# Altium schematic sheet USB-PD.SchDoc
size A2; SheetNumber: 2; SheetTotal: 17
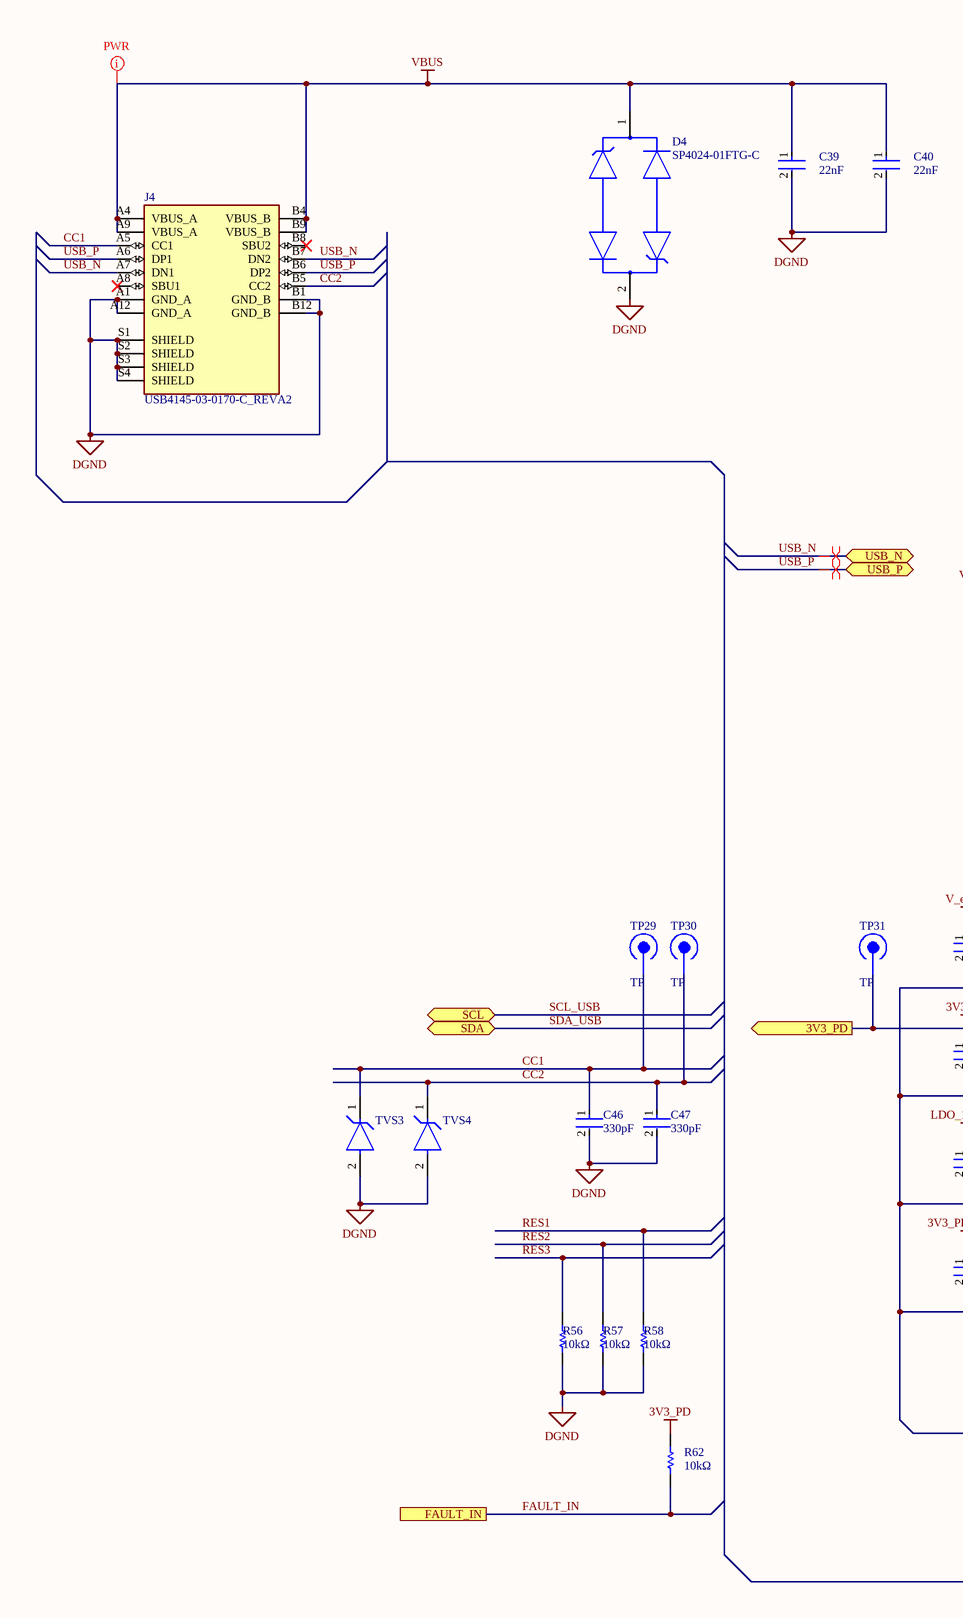
[diagram p0: USB-PD.SchDoc, left]
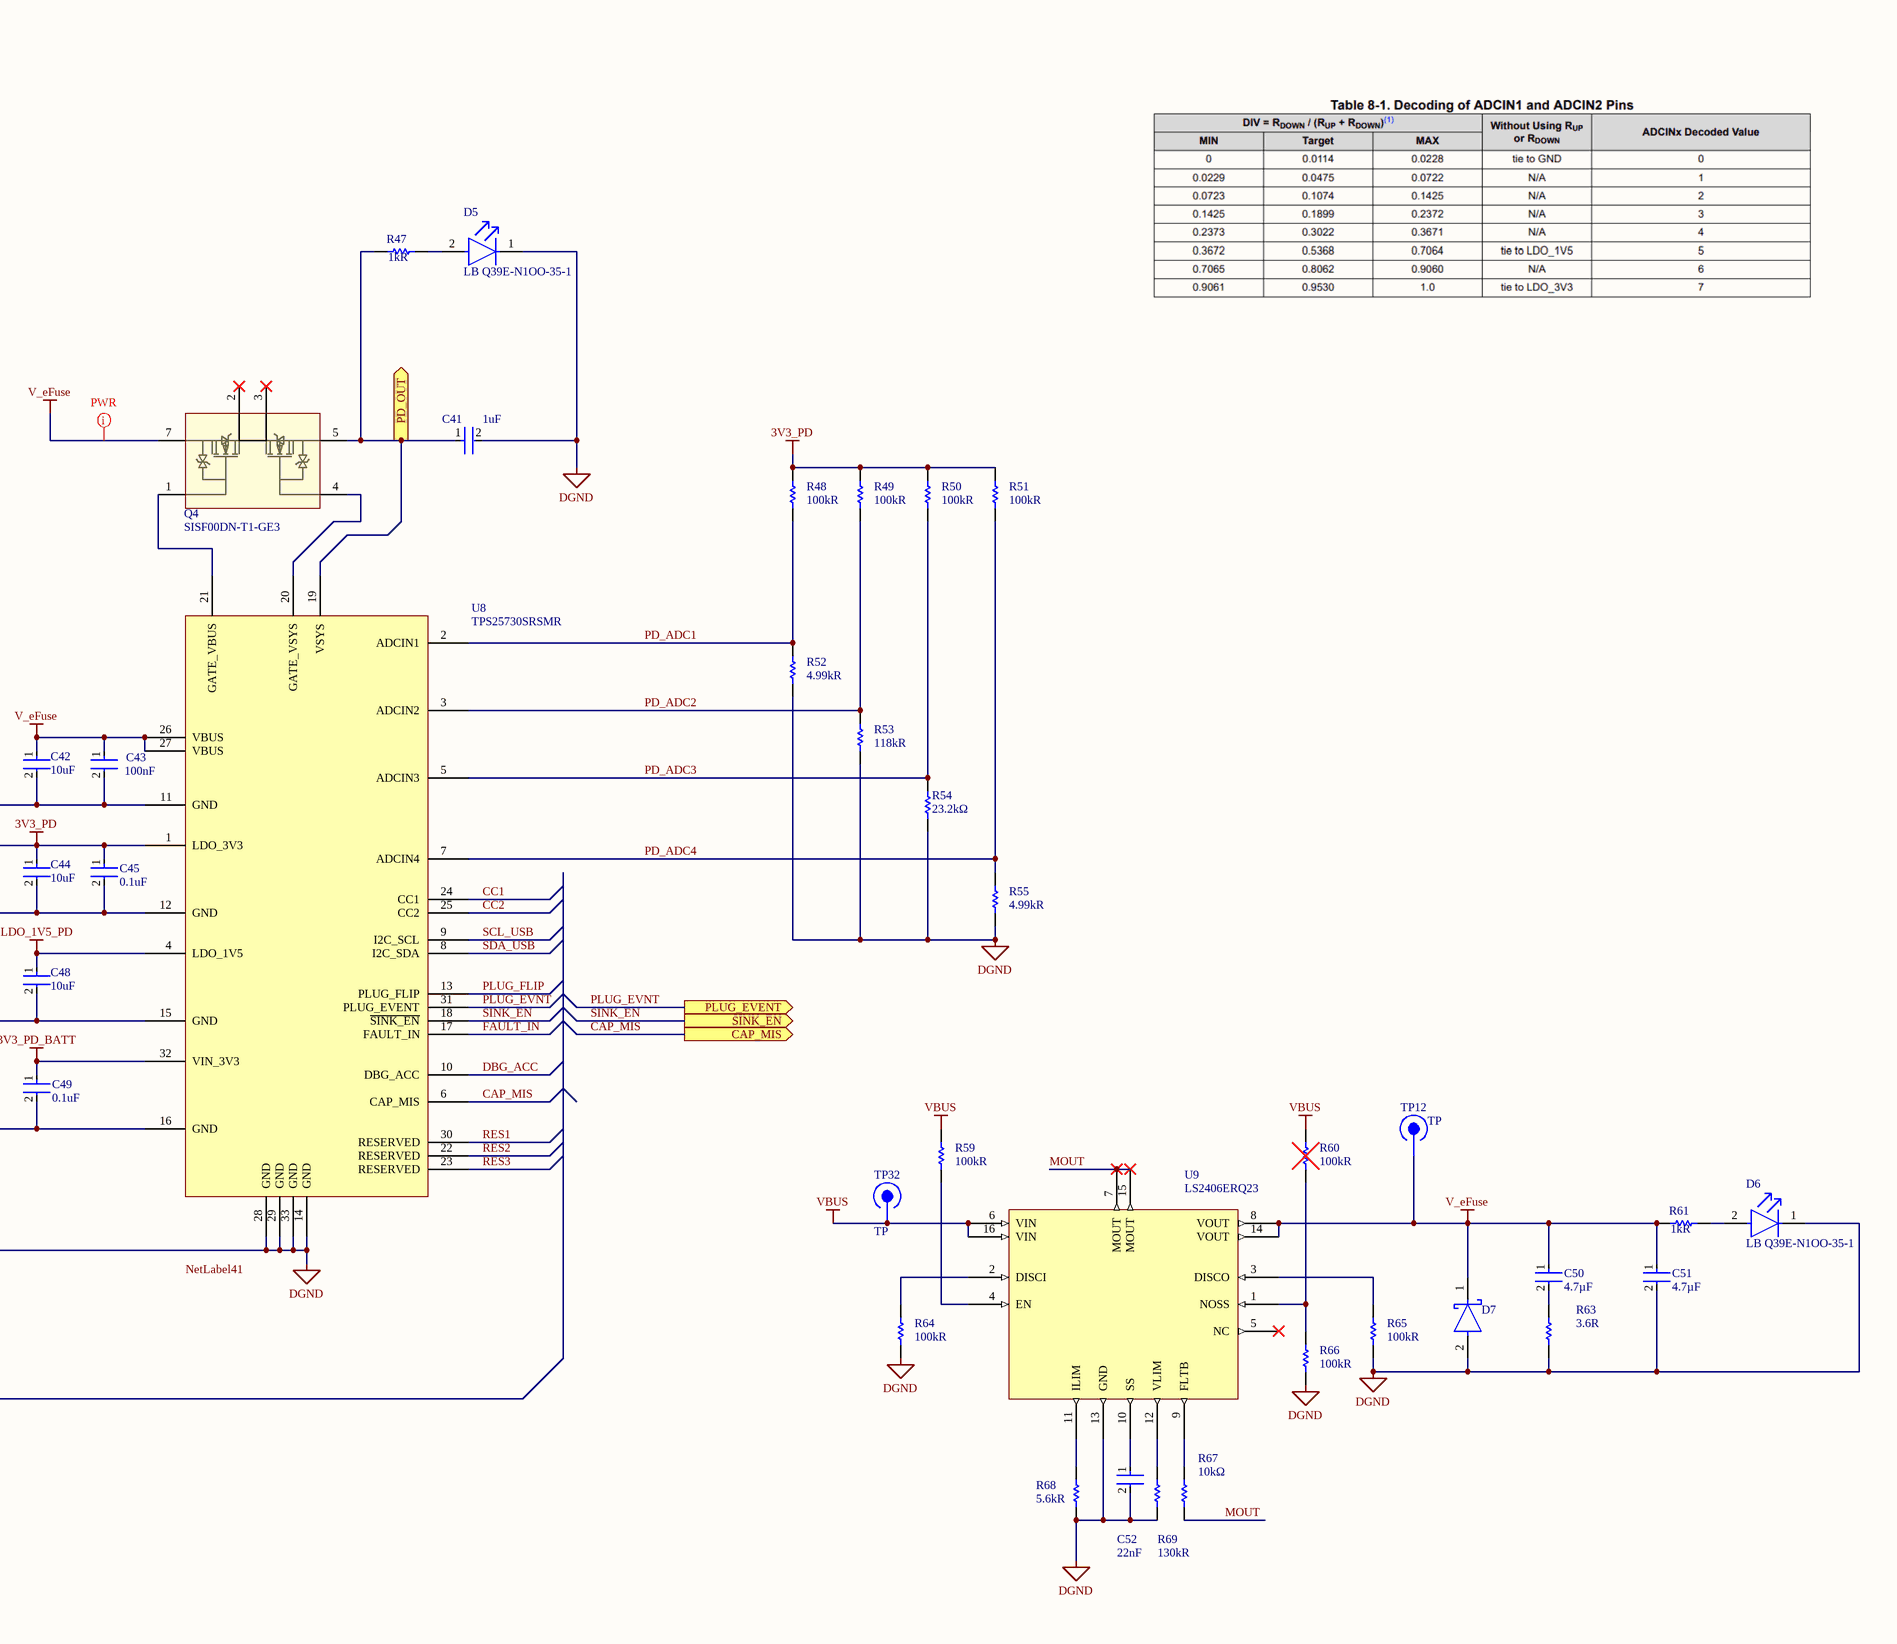
[diagram p1: USB-PD.SchDoc, right]

## Parts
C39  value 22nF  [FP-GRM155-0_05-MFG]  (hidden comment: GRM155R71H223KA12D)
C40  value 22nF  [FP-GRM155-0_05-MFG]  (hidden comment: GRM155R71H223KA12D)
C41  value 1uF  [FP-GCM188-0_1-IPC_B]  (hidden comment: GCM188R71E105KA64J)
C42  value 10uF  [FP-GRM155-0_2-MFG]  (hidden comment: GRM155R61A106ME11D)
C43  value 100nF  [FP-CC0402-IPC_B]  (hidden comment: CC0402KRX7R9BB104)
C44  value 10uF  [FP-GRM155-0_2-MFG]  (hidden comment: GRM155R61A106ME11D)
C45  value 0.1uF  [FP-CC0402-IPC_C]  (hidden comment: CC0402KRX7R7BB104)
C46  value 330pF  [FP-C0402-BB-MFG]  (hidden comment: C0402C331K5RACTU)
C47  value 330pF  [FP-C0402-BB-MFG]  (hidden comment: C0402C331K5RACTU)
C48  value 10uF  [FP-GRM155-0_2-MFG]  (hidden comment: GRM155R61A106ME11D)
C49  value 0.1uF  [FP-CC0402-IPC_C]  (hidden comment: CC0402KRX7R7BB104)
C50  value 4.7µF  [FP-GRM21B-0_15-IPC_A]  (hidden comment: GRM21BR61H475KE51L)
C51  value 4.7µF  [FP-GRM21B-0_15-IPC_A]  (hidden comment: GRM21BR61H475KE51L)
C52  value 22nF  [FP-GRM155-0_05-MFG]  (hidden comment: GRM155R71H223KA12D)
D4  SP4024-01FTG-C  [FP-SP4024-CA-MFG]
D5  LB Q39E-N1OO-35-1  [FP-LB_Q39E-MFG]
D6  LB Q39E-N1OO-35-1  [FP-LB_Q39E-MFG]
D7  PMEG4030ER,115  [FP-SOD123W-MFG]  (value not drawn)
J4  USB4145-03-0170-C_REVA2  [GCT_USB4145-03-0170-C_REVA2]
Q4  SISF00DN-T1-GE3  [New footprint 1]
R47  value 1kR  [FP-ERA2A-MFG]  (hidden comment: ERA-2AEB102X)
R48  value 100kR  [RESC1005X40X25LL10T10]  (hidden comment: RK73H1ETTP1003F)
R49  value 100kR  [RESC1005X40X25LL10T10]  (hidden comment: RK73H1ETTP1003F)
R50  value 100kR  [RESC1005X40X25LL10T10]  (hidden comment: RK73H1ETTP1003F)
R51  value 100kR  [RESC1005X40X25LL10T10]  (hidden comment: RK73H1ETTP1003F)
R52  value 4.99kR  [RESC1005X40X25LL10T10]  (hidden comment: RK73H1ETTP4991F)
R53  value 118kR  [RESC1005X40X25LL10T10]  (hidden comment: RK73H1ETTP1183F)
R54  value 23.2kΩ  [RESC1005X40X25LL10T10]  (hidden comment: RK73H1ETTP2322F)
R55  value 4.99kR  [RESC1005X40X25LL10T10]  (hidden comment: RK73H1ETTP4991F)
R56  value 10kΩ  [RESC1005X40X25LL10T10]  (hidden comment: RK73B1ETTP103J)
R57  value 10kΩ  [RESC1005X40X25LL10T10]  (hidden comment: RK73B1ETTP103J)
R58  value 10kΩ  [RESC1005X40X25LL10T10]  (hidden comment: RK73B1ETTP103J)
R59  value 100kR  [RESC1005X40X25LL10T10]  (hidden comment: RK73H1ETTP1003F)
R60  value 100kR  [RESC1005X40X25LL10T10]  (hidden comment: RK73H1ETTP1003F)  (no BOM)
R61  value 1kR  [FP-ERA2A-MFG]  (hidden comment: ERA-2AEB102X)
R62  value 10kΩ  [RESC1005X40X25LL10T10]  (hidden comment: RK73B1ETTP103J)
R63  value 3.6R  [FP-RK73H2A-MFG]  (hidden comment: RK73H2ATTD3R60F)
R64  value 100kR  [RESC1005X40X25LL10T10]  (hidden comment: RK73H1ETTP1003F)
R65  value 100kR  [RESC1005X40X25LL10T10]  (hidden comment: RK73H1ETTP1003F)
R66  value 100kR  [RESC1005X40X25LL10T10]  (hidden comment: RK73H1ETTP1003F)
R67  value 10kΩ  [RESC1005X40X25LL10T10]  (hidden comment: RK73B1ETTP103J)
R68  value 5.6kR  [RESC1005X40X25LL10T10]  (hidden comment: RK73H1ETTP5601F)
R69  value 130kR  [RESC1005X40X25NL10T10]  (hidden comment: RK73H1ETTP1303F)
TP12  TP  [TP-Footprint-1]
TP29  TP  [TP-Footprint-1]
TP30  TP  [TP-Footprint-1]
TP31  TP  [TP-Footprint-1]
TP32  TP  [TP-Footprint-1]
TVS3  PESD5Z5.0,115  [DIO_BAS716,115]  (value not drawn)
TVS4  PESD5Z5.0,115  [DIO_BAS716,115]  (value not drawn)
U8  TPS25730SRSMR  [QFN40P400X400X100_HS-33N]
U9  LS2406ERQ23  [LS2406ERQ23-Footprint-1]

## Ports
3V3_PD (out), CAP_MIS (out), FAULT_IN, PD_OUT (out), PLUG_EVENT (out), SCL (bidir), SDA (bidir), SINK_EN (out), USB_N (bidir), USB_P (bidir)

## Nets
3V3_PD: C44.1 C45.1 R48.2 R49.2 R50.2 R51.2 R62.2 TP31.1 U8.1(LDO_3V3) ; port 3V3_PD
3V3_PD_BATT: C49.1 U8.32(VIN_3V3)
DGND: C39.2 C40.2 C41.2 C42.2 C43.2 C44.2 C45.2 C46.2 C47.2 C48.2 C49.2 C51.2 C52.2 D4.2 D5.1(C) D6.1(C) D7.2(A) J4.A1(GND_A) J4.A12(GND_A) J4.B1(GND_B) J4.B12(GND_B) J4.S1(SHIELD) J4.S2(SHIELD) J4.S3(SHIELD) J4.S4(SHIELD) R52.1 R53.1 R54.1 R55.1 R56.1 R57.1 R58.1 R63.1 R64.1 R65.1 R66.1 R68.1 R69.1 TVS3.2 TVS4.2 U8.11(GND) U8.12(GND) U8.14(GND) U8.15(GND) U8.16(GND) U8.28(GND) U8.29(GND) U8.33(GND) U9.13(GND)
LDO_1V5_PD: C48.1 U8.4(LDO_1V5)
V_eFuse: C42.1 C43.1 C50.1 C51.1 D7.1(C) Q4.7(S1) R61.2 TP12.1 U8.26(VBUS) U8.27(VBUS) U9.8(VOUT) U9.14(VOUT)
VBUS: C39.1 C40.1 D4.1 J4.A4(VBUS_A) J4.A9(VBUS_A) J4.B4(VBUS_B) J4.B9(VBUS_B) R59.2 R60.2 TP32.1 U9.6(VIN) U9.16(VIN)
CAP_MIS: U8.6(CAP_MIS) ; port CAP_MIS
CC1: C46.1 J4.A5(CC1) TP29.1 TVS3.1 U8.24(CC1)
CC2: C47.1 J4.B5(CC2) TP30.1 TVS4.1 U8.25(CC2)
DBG_ACC: U8.10(DBG_ACC)
FAULT_IN: R62.1 U8.17(FAULT_IN) ; port FAULT_IN
MOUT: R67.1 U9.7(MOUT) U9.15(MOUT)
PD_ADC1: R48.1 R52.2 U8.2(ADCIN1)
PD_ADC2: R49.1 R53.2 U8.3(ADCIN2)
PD_ADC3: R50.1 R54.2 U8.5(ADCIN3)
PD_ADC4: R51.1 R55.2 U8.7(ADCIN4)
PD_OUT: C41.1 Q4.5(S2) R47.2 U8.19(VSYS) ; port PD_OUT
PLUG_EVNT: U8.31(PLUG_EVENT) ; port PLUG_EVENT
PLUG_FLIP: U8.13(PLUG_FLIP)
RES1: R58.2 U8.30(RESERVED)
RES2: R57.2 U8.22(RESERVED)
RES3: R56.2 U8.23(RESERVED)
SCL_USB: U8.9(I2C_SCL) ; port SCL
SDA_USB: U8.8(I2C_SDA) ; port SDA
SINK_EN: U8.18(~{SINK_EN}) ; port SINK_EN
USB_N: J4.A7(DN1) J4.B7(DN2) ; port USB_N
USB_P: J4.A6(DP1) J4.B6(DP2) ; port USB_P
NetC50_2: C50.2 R63.2
NetC52_1: C52.1 U9.10(SS)
NetD5_2: D5.2(A) R47.1
NetD6_2: D6.2(A) R61.1
NetQ4_1: Q4.1(G1) U8.21(GATE_VBUS)
NetQ4_4: Q4.4(G2) U8.20(GATE_VSYS)
NetR59_1: R59.1 U9.4(EN)
NetR60_1: R60.1 R66.2 U9.1(NOSS)
NetR64_2: R64.2 U9.2(DISCI)
NetR65_2: R65.2 U9.3(DISCO)
NetR67_2: R67.2 U9.9(FLTB)
NetR68_2: R68.2 U9.11(ILIM)
NetR69_2: R69.2 U9.12(VLIM)

Not connected (* = marked no-connect by the designer): J4 A8(SBU1)* B8(SBU2)*; Q4 2(S1)* 3(S1)*; U9 5(NC)*

## Layout directives
net class PWR: V_eFuse, VBUS
differential pair; differential pair class USB90_DIFF: USB_N, USB_P

## Notes on the sheet
- Labels drawn without touching a wire or pin: NetLabel41

## Library data of the parts
C39 C40 C52 = CMP-x00115-1: Ceramic Capacitor, Multilayer, Ceramic, 50V, 10% +Tol, 10% -Tol, X7R, 15% TC, 0.022uF, Surface Mount, 0402; Manufacturer: Murata; Vendor: TTI; Template: MR_0402; Reel Width: 8mm; MOQ: 10000; Category: Capacitor; Package: 0402; Price: 0.00395; Mounting: SMT
C41 = CMP-x00092-1: Ceramic Capacitor, Multilayer, Ceramic, 25V, 10% +Tol, 10% -Tol, X7R, 15% TC, 1uF, Surface Mount, 0603; Manufacturer: Murata; Vendor: TTI; Template: MR_1608; Reel Width: 8mm; Package: 1608; Category: Capacitors; Price: 0.0268; MOQ: 50000; Mounting: SMT
C42 C44 C48 = CMP-x00183-1: Ceramic Capacitor, Multilayer, Ceramic, 10V, 20% +Tol, 20% -Tol, X5R, 15% TC, 10uF, Surface Mount, 0402
C43 = CMP-x00152-1: Ceramic Capacitor, Multilayer, Ceramic, 50V, 10% +Tol, 10% -Tol, X7R, 15% TC, 0.1uF, Surface Mount, 0402
C45 C49 = CMP-001-00094-1: Multilayer Ceramic Capacitor, 0.1 uF, 25 V, ± 10%, X7R, 0402 [1005 Metric]; Rating: 16V; Reel Size: 8mm; Vendor: TTI; Category: Capacitor; Price: 0.004; Package: 0402; MOQ: 10000
C46 C47 = CMP-x00111-1: Ceramic Capacitor, Multilayer, Ceramic, 50V, 10% +Tol, 10% -Tol, X7R, 15% TC, 0.00033uF, Surface Mount, 0402; Manufacturer: Kemet; Vendor: TTI; Template: KM_0402; Reel Width: 8mm; Mounting: SMT; Price: 0.003; MOQ: 10000; Category: Capacitor; Package: 0402
C50 C51 = CMP-001-00268-1: Ceramic Capacitor, Multilayer, Ceramic, 50V, 10% +Tol, 10% -Tol, X5R, 15% TC, 4.7uF, Surface Mount, 0805; Mounting Technology: Surface Mount; Pins: 2; Min Operating Temperature: -55°C; Max Operating Temperature: 85°C; Case/Package: 0805; Capacitor Type: Ceramic; RoHS Compliant: Yes
D4 = CMP-x00114-1: Trans Voltage Suppressor Diode, 350W, 24V V(RWM), Bidirectional, 1 Element, Silicon; Manufacturer: Littelfuse; Reel Width: 8mm; Vendor: TTI; Template: LF_SOD_323; Package: SOD_323_2; Category: TVS Dioded; MOQ: 3000; Value: 24V; Mounting: SMT; Price: 0.165
D5 D6 = CMP-62016-000029-1: LED BLUE DIFFUSED 0603 SMD; Lens Color: White; Viewing Angle: 130°; Dominant Wavelength: 470nm; Lens Style: Flat; Luminous Intensity: 42mcd; Forward Voltage: 2.85V; Test Current: 5mA; Number of LEDs: 1; Lens Size: 0.8mm; Luminous Flux: 0.13lm; Case/Package: 0603; Lens Transparency: Diffused; Case Code (Imperial): 0603; Width: 0.8mm; Height: 0.4mm; Color: Blue; Mount: Surface Mount; Packaging: Tape and Reel; Number of Pins: 2; Length: 1.6mm; Radiation Hardening: No; Case Code (Metric): 1608
D7 = CMP-x00083-1: Rectifier Diode, Schottky, 1 Phase, 1 Element, 3A, 40V V(RRM), Silicon; Manufacturer: Nexperia; Vendor: TTI; Template: NX_SOD_123W_2; Reel Width: 8mm; Category: Diodes; Package: SOD-123W-2; MOQ: 3000; Value: 3A; Mounting: SMT; Price: 0.072
J4 = CMP-349-000000-01-A-2: Value: *; Availability: Unavailable; Pin Count: 20; Price: None; Package: None; Source: USB4145-03-0170-C_REVA2.SchLib; Design Item ID: USB4145-03-0170-C_REVA2; Component Type: Standard; MP: USB4145-03-0170-C_REVA2
Q4 = CMP-x00106-2: Power Field-Effect Transistor; Manufacturer: Vishay; Vendor: TTI; Template: VS_PP12_8; Value: 30V; Reel Width: 12mm; Category: Integrated Circuit; Package: PP12-8; Price: 0.544; MOQ: 3000; Mounting: SMT
R47 R61 = CMP-x00015-3: Fixed Resistor, Thin Film, 0.063W, 1000ohm, 50V, 0.1% +/-Tol, 25ppm/Cel, Surface Mount, 0402; Manufacturer: Panasonic; Rating: 63mW; Vendor: TTI; Reel Width: 8mm; Template: PS_0402; Price: 0.0357; Category: Resistor; MOQ: 10000; Mounting: SMT; Package: 0402
R48-R51 R59 R60 R64-R66 = CMP-x00162-1: Fixed Resistor, Metal Glaze/thick Film, 0.1W, 100000ohm, 75V, 1% +/-Tol, 100ppm/Cel, Surface Mount, 0402
R52 R55 = CMP-x00172-1: Fixed Resistor, Metal Glaze/thick Film, 0.1W, 4990ohm, 75V, 1% +/-Tol, 100ppm/Cel, Surface Mount, 0402
R53 = CMP-x00173-1: Fixed Resistor, Metal Glaze/thick Film, 0.1W, 118000ohm, 75V, 1% +/-Tol, 100ppm/Cel, Surface Mount, 0402
R54 = CMP-009-00229-1: Fixed Resistor, Metal Glaze/thick Film, 0.1W, 23200ohm, 75V, 1% +/-Tol, 100ppm/Cel, Surface Mount, 0402; Vendor: TTI; Rating: 1/10W; Category: Resistor; Package: 0402; Price: 0.00295
R56-R58 R62 R67 = CMP-009-00227-1: Fixed Resistor, Metal Glaze/thick Film, 0.1W, 10000ohm, 75V, 5% +/-Tol, 200ppm/Cel, Surface Mount, 0402; Rating: 1/10W; Vendor: TTI; Package: 0402; Price: 0.0017; Category: Resistor
R63 = CMP-x00167-1: Fixed Resistor, Metal Glaze/thick Film, 0.25W, 3.6ohm, 150V, 1% +/-Tol, 200ppm/Cel, Surface Mount, 0805
R68 = CMP-x00164-1: Fixed Resistor, Metal Glaze/thick Film, 0.1W, 5600ohm, 75V, 1% +/-Tol, 100ppm/Cel, Surface Mount, 0402
R69 = CMP-2002-03957-1: Manufacturer: KOA Speer; Part Number: RK73H1ETTP1303F
TP12 TP29-TP32 = CMP-001-0086-3: digital shovel test point
TVS3 TVS4 = CMP-x00209-4: Trans Voltage Suppressor Diode, 180W, 5V V(RWM), Unidirectional, 1 Element, Silicon; Manufacturer: Nexperia; Template: NX_SOD_523_2; Mounting: SMD; Category: Diodes; Package: SOD_523_2
U8 = CMP-x00105-1: Sink-only USB Type-C® and USB Power Delivery (PD) controller with no firmware development required 32-VQFN -40 to 125; Manufacturer: Texas Instruments; Template: TI_VQFN_32; Reel Width: 12mm; Category: Integrated Circuit; Mounting: SMT; Package: 32-VQFN; Value: -; Price: 0.8; MOQ: 1000; Vendor: Texas Instruments
U9 = CMP-x00113-1: 28V/6A Efuse With True Rcb & Frs; Manufacturer: Littelfuse; Reel Width: 12mm; Template: LF_QFN_16; Vendor: TTI; Category: Integrated Circuit; Mounting: SMT; Package: QFN_16; MOQ: 5000; Price: 1.37; Value: -